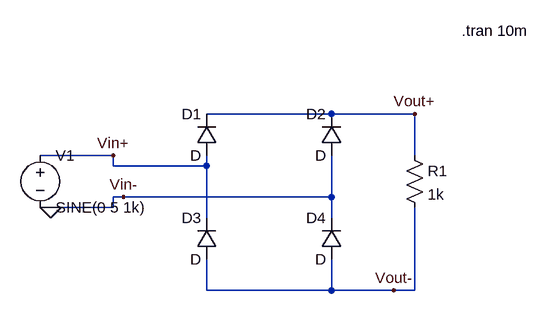
[diagram p0: schematic PontDeGraetz.asc]
PontDeGraetz.asc, the LTspice schematic file:
Version 4
SHEET 1 880 680
WIRE 288 80 96 80
WIRE 416 80 288 80
WIRE -48 144 -160 144
WIRE 416 144 416 80
WIRE -48 160 -48 144
WIRE 96 160 96 144
WIRE 96 160 -48 160
WIRE -32 208 -48 208
WIRE 288 208 288 144
WIRE 288 208 -32 208
WIRE -144 224 -160 224
WIRE -48 224 -48 208
WIRE -48 224 -144 224
WIRE 96 240 96 160
WIRE 288 240 288 208
WIRE 96 352 96 304
WIRE 288 352 288 304
WIRE 288 352 96 352
WIRE 384 352 288 352
WIRE 416 352 416 224
WIRE 416 352 384 352
FLAG -144 224 0
FLAG -48 144 Vin+
FLAG -32 208 Vin-
FLAG 416 80 Vout+
FLAG 384 352 Vout-
SYMBOL diode 112 144 R180
WINDOW 0 24 64 Left 2
WINDOW 3 24 0 Left 2
SYMATTR InstName D1
SYMBOL diode 304 144 R180
WINDOW 0 24 64 Left 2
WINDOW 3 24 0 Left 2
SYMATTR InstName D2
SYMBOL diode 112 304 R180
WINDOW 0 24 64 Left 2
WINDOW 3 24 0 Left 2
SYMATTR InstName D3
SYMBOL diode 304 304 R180
WINDOW 0 24 64 Left 2
WINDOW 3 24 0 Left 2
SYMATTR InstName D4
SYMBOL res 400 128 R0
SYMATTR InstName R1
SYMATTR Value 1k
SYMBOL voltage -160 128 R0
WINDOW 123 0 0 Left 0
WINDOW 39 0 0 Left 0
SYMATTR InstName V1
SYMATTR Value SINE(0 5 1k)
TEXT 488 -48 Left 2 !.tran 10m

The netlist it stands for:
* PontDeGraetz.asc
D1 Vin+ Vout+ D
D2 0 Vout+ D
D3 Vout- Vin+ D
D4 Vout- 0 D
R1 Vout+ Vout- 1k
V1 Vin+ 0 SINE(0 5 1k)
.model D D
.lib standard.dio
.tran 10m
.backanno
.end